# Altium schematic sheet MCU.SchDoc
size A4; Revision: B.2
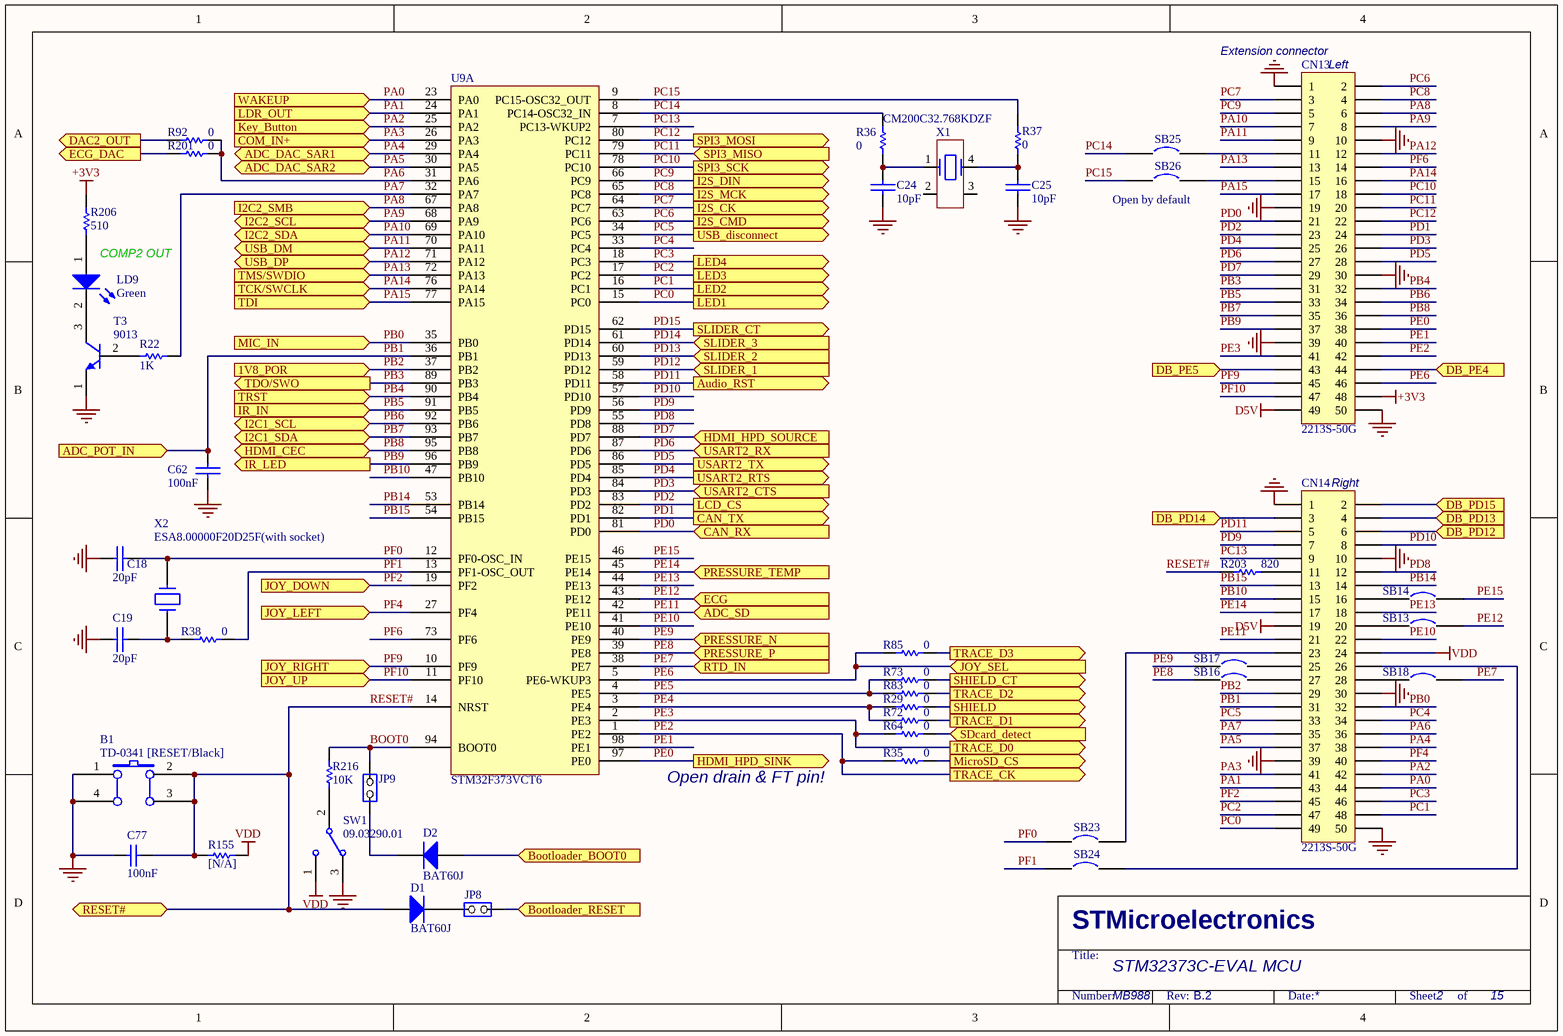
[diagram p0: MCU.SchDoc]

## Parts
B1  TD-0341 [RESET/Black]  [PB10]
C18  20pF  [0603C]
C19  20pF  [0603C]
C24  10pF  [0603C]
C25  10pF  [0603C]
C62  100nF  [0603C]
C77  100nF  [0603C]
CN13  2213S-50G  [2*25P]
CN14  2213S-50G  [2*25P]
D1  BAT60J  [SOD-323]
D2  BAT60J  [SOD-323]
JP8  (no value)  [SIP2]
JP9  (no value)  [SIP2]
LD9  Green  [0603D]
R22  1K  [0603R]
R29  0  [0603R]
R35  0  [0603R]
R36  0  [0603R]
R37  0  [0603R]
R38  0  [0603R]
R64  0  [0603R]
R72  0  [0603R]
R73  0  [0603R]
R83  0  [0603R]
R85  0  [0603R]
R92  0  [0603R]
R155  [N/A]  [0603R]
R201  0  [0603R]
R203  820  [0603R]
R206  510  [0603R]
R216  10K  [0603R]
SB13  (no value)  [JP2_SMD]
SB14  (no value)  [JP2_SMD]
SB16  (no value)  [JP2_SMD]
SB17  (no value)  [JP2_SMD]
SB18  (no value)  [JP2_SMD]
SB23  (no value)  [JP2_SMD]
SB24  (no value)  [JP2_SMD]
SB25  (no value)  [JP2_SMD]
SB26  (no value)  [JP2_SMD]
SW1  09.03290.01  [SIP3]
T3  9013  [SOT-23]
U9  STM32F373VCT6  [IC149-100-025-B5]  (part A of 2)
X1  CM200C32.768KDZF  [SM8]
X2  ESA8.00000F20D25F(with socket)  [XTAL_socket]

## Ports
1V8_POR (in), ADC_DAC_SAR1 (bidir), ADC_DAC_SAR2 (bidir), ADC_POT_IN (in), ADC_SD (in), Audio_RST (out), Bootloader_BOOT0 (in), Bootloader_RESET (in), CAN_RX (in), CAN_TX (out), COM_IN+ (in), DAC2_OUT (out), DB_PD12 (in), DB_PD13 (in), DB_PD14 (in), DB_PD15 (in), DB_PE4 (in), DB_PE5 (in), ECG (in), ECG_DAC (out), HDMI_CEC (bidir), HDMI_HPD_SINK (out), HDMI_HPD_SOURCE (in), I2C1_SCL (bidir), I2C1_SDA (bidir), I2C2_SCL (bidir), I2C2_SDA (bidir), I2C2_SMB (in), I2S_CK (out), I2S_CMD (out), I2S_DIN (out), I2S_MCK (out), IR_IN (in), IR_LED (out), JOY_DOWN (in), JOY_LEFT (in), JOY_RIGHT (in), JOY_SEL (in), JOY_UP (in), Key_Button (in), LCD_CS (out), LDR_OUT (in), LED1 (out), LED2 (out), LED3 (out), LED4 (out), MIC_IN (in), MicroSD_CS (out), PRESSURE_N (in), PRESSURE_P (in), PRESSURE_TEMP (in), RESET# (bidir), RTD_IN (in), SDcard_detect (in), SHIELD (out), SHIELD_CT (out), SLIDER_1 (in), SLIDER_2 (in), SLIDER_3 (in), SLIDER_CT (out), SPI3_MISO (in), SPI3_MOSI (out), SPI3_SCK (out), TCK/SWCLK (in), TDI (in), TDO/SWO (out), TMS/SWDIO (in), TRACE_CK (out), TRACE_D0 (out), TRACE_D1 (out), TRACE_D2 (out), TRACE_D3 (out), TRST (in), USART2_CTS (in), USART2_RTS (out), USART2_RX (in), USART2_TX (out), USB_disconnect (out), USB_DM (bidir), USB_DP (bidir), WAKEUP (in)

## Nets
+3V3: CN13.48 R206.1
D5V: CN13.49 CN14.19
GND: B1.1(A0) B1.4(A1) C18.2 C19.2 C24.2 C25.2 C62.1 C77.1 CN13.1 CN13.10 CN13.19 CN13.30 CN13.39 CN13.50 CN14.1 CN14.10 CN14.30 CN14.39 CN14.50 SW1.3 T3.1(E)
VDD: CN14.24 R155.2 SW1.1
BOOT0: JP9.2(NO) R216.1 U9.94(BOOT0)
Bootloader_BOOT0: D2.1(A) ; port Bootloader_BOOT0
Bootloader_RESET: JP8.2(NO) ; port Bootloader_RESET
DAC2_OUT: R92.2 ; port DAC2_OUT
DB_PD12: CN14.6 ; port DB_PD12
DB_PD13: CN14.4 ; port DB_PD13
DB_PD14: CN14.3 ; port DB_PD14
DB_PD15: CN14.2 ; port DB_PD15
DB_PE4: CN13.44 ; port DB_PE4
DB_PE5: CN13.43 ; port DB_PE5
ECG_DAC: R201.2 ; port ECG_DAC
MicroSD_CS: R35.1 ; port MicroSD_CS
PA0: CN14.44 U9.23(PA0) ; port WAKEUP
PA1: CN14.43 U9.24(PA1) ; port LDR_OUT
PA2: CN14.42 U9.25(PA2) ; port Key_Button
PA3: CN14.41 U9.26(PA3) ; port COM_IN+
PA4: CN14.38 U9.29(PA4) ; port ADC_DAC_SAR1
PA5: CN14.37 U9.30(PA5) ; port ADC_DAC_SAR2
PA6: CN14.36 R92.1 R201.1 U9.31(PA6)
PA7: CN14.35 R22.2 U9.32(PA7)
PA8: CN13.6 U9.67(PA8) ; port I2C2_SMB
PA9: CN13.8 U9.68(PA9) ; port I2C2_SCL
PA10: CN13.7 U9.69(PA10) ; port I2C2_SDA
PA11: CN13.9 U9.70(PA11) ; port USB_DM
PA12: CN13.12 U9.71(PA12) ; port USB_DP
PA13: CN13.13 U9.72(PA13) ; port TMS/SWDIO
PA14: CN13.16 U9.76(PA14) ; port TCK/SWCLK
PA15: CN13.17 U9.77(PA15) ; port TDI
PB0: CN14.32 U9.35(PB0) ; port MIC_IN
PB1: C62.2 CN14.31 U9.36(PB1) ; port ADC_POT_IN
PB2: CN14.29 U9.37(PB2) ; port 1V8_POR
PB3: CN13.31 U9.89(PB3) ; port TDO/SWO
PB4: CN13.32 U9.90(PB4) ; port TRST
PB5: CN13.33 U9.91(PB5) ; port IR_IN
PB6: CN13.34 U9.92(PB6) ; port I2C1_SCL
PB7: CN13.35 U9.93(PB7) ; port I2C1_SDA
PB8: CN13.36 U9.95(PB8) ; port HDMI_CEC
PB9: CN13.37 U9.96(PB9) ; port IR_LED
PB10: CN14.15 U9.47(PB10)
PB14: CN14.14 U9.53(PB14)
PB15: CN14.13 U9.54(PB15)
PC0: CN14.49 U9.15(PC0) ; port LED1
PC1: CN14.48 U9.16(PC1) ; port LED2
PC2: CN14.47 U9.17(PC2) ; port LED3
PC3: CN14.46 U9.18(PC3) ; port LED4
PC4: CN14.34 U9.33(PC4)
PC5: CN14.33 U9.34(PC5) ; port USB_disconnect
PC6: CN13.2 U9.63(PC6) ; port I2S_CMD
PC7: CN13.3 U9.64(PC7) ; port I2S_CK
PC8: CN13.4 U9.65(PC8) ; port I2S_MCK
PC9: CN13.5 U9.66(PC9) ; port I2S_DIN
PC10: CN13.18 U9.78(PC10) ; port SPI3_SCK
PC11: CN13.20 U9.79(PC11) ; port SPI3_MISO
PC12: CN13.22 U9.80(PC12) ; port SPI3_MOSI
PC13: CN14.9 U9.7(PC13-WKUP2)
PC14: R36.2 SB25.1 U9.8(PC14-OSC32_IN)
PC15: R37.2 SB26.1 U9.9(PC15-OSC32_OUT)
PD0: CN13.21 U9.81(PD0) ; port CAN_RX
PD1: CN13.24 U9.82(PD1) ; port CAN_TX
PD2: CN13.23 U9.83(PD2) ; port LCD_CS
PD3: CN13.26 U9.84(PD3) ; port USART2_CTS
PD4: CN13.25 U9.85(PD4) ; port USART2_RTS
PD5: CN13.28 U9.86(PD5) ; port USART2_TX
PD6: CN13.27 U9.87(PD6) ; port USART2_RX
PD7: CN13.29 U9.88(PD7) ; port HDMI_HPD_SOURCE
PD8: CN14.12 U9.55(PD8)
PD9: CN14.7 U9.56(PD9)
PD10: CN14.8 U9.57(PD10)
PD11: CN14.5 U9.58(PD11) ; port Audio_RST
PD12: U9.59(PD12) ; port SLIDER_1
PD13: U9.60(PD13) ; port SLIDER_2
PD14: U9.61(PD14) ; port SLIDER_3
PD15: U9.62(PD15) ; port SLIDER_CT
PE0: CN13.38 U9.97(PE0) ; port HDMI_HPD_SINK
PE1: CN13.40 U9.98(PE1)
PE2: CN13.42 R35.2 U9.1(PE2) ; port TRACE_CK
PE3: CN13.41 R64.2 U9.2(PE3) ; port TRACE_D0
PE4: R29.2 R72.2 U9.3(PE4)
PE5: R73.2 R83.2 U9.4(PE5)
PE6: CN13.46 R85.2 U9.5(PE6-WKUP3) ; port JOY_SEL
PE7: SB18.2 U9.38(PE7) ; port RTD_IN
PE8: SB16.1 U9.39(PE8) ; port PRESSURE_P
PE9: SB17.1 U9.40(PE9) ; port PRESSURE_N
PE10: CN14.22 U9.41(PE10)
PE11: CN14.21 U9.42(PE11) ; port ADC_SD
PE12: SB13.2 U9.43(PE12) ; port ECG
PE13: CN14.18 U9.44(PE13)
PE14: CN14.17 U9.45(PE14) ; port PRESSURE_TEMP
PE15: SB14.2 U9.46(PE15)
PF0: C18.1 SB23.1 U9.12(PF0-OSC_IN) X2.2
PF1: R38.1 SB24.1 U9.13(PF1-OSC_OUT)
PF2: CN14.45 U9.19(PF2) ; port JOY_DOWN
PF4: CN14.40 U9.27(PF4) ; port JOY_LEFT
PF6: CN13.14 U9.73(PF6)
PF9: CN13.45 U9.10(PF9) ; port JOY_RIGHT
PF10: CN13.47 U9.11(PF10) ; port JOY_UP
RESET#: B1.2(B0) B1.3(B1) C77.2 D1.1(A) R155.1 R203.2 U9.14(NRST) ; port RESET#
SDcard_detect: R64.1 ; port SDcard_detect
SHIELD: R29.1 ; port SHIELD
SHIELD_CT: R73.1 ; port SHIELD_CT
TRACE_D1: R72.1 ; port TRACE_D1
TRACE_D2: R83.1 ; port TRACE_D2
TRACE_D3: R85.1 ; port TRACE_D3
NetC19_1: C19.1 R38.2 X2.1
NetC24_1: C24.1 R36.1 X1.1
NetC25_1: C25.1 R37.1 X1.4
NetCN13_11: CN13.11 SB25.2
NetCN13_15: CN13.15 SB26.2
NetCN14_11: CN14.11 R203.1
NetCN14_16: CN14.16 SB14.1
NetCN14_20: CN14.20 SB13.1
NetCN14_23: CN14.23 SB23.2
NetCN14_25: CN14.25 SB17.2
NetCN14_26: CN14.26 SB24.2
NetCN14_27: CN14.27 SB16.2
NetCN14_28: CN14.28 SB18.1
NetD1_2: D1.2(K) JP8.1(COMMON)
NetD2_2: D2.2(K) JP9.1(COMMON)
NetLD9_1: LD9.1(A) R206.2
NetLD9_2: LD9.2(K) T3.3(C)
NetR22_1: R22.1 T3.2(B)
NetR216_2: R216.2 SW1.2

Not connected (* = marked no-connect by the designer): X1 2 3

## Notes on the sheet
- (near CN13) Extension connector
- (near CN13) Left
- (near SB26) Open by default
- COMP2 OUT
- (near CN14) Right
- Open drain & FT pin!
- STM32373C-EVAL MCU
- MB988
- 2
- 15
- STMicroelectronics
- Title:
- Number:
- Rev:
- Date:
- Sheet       of

## Library data of the parts
B1 = SW PUSHBUTTON: SE PUSHBUTTON
C18 C19 C24 C25 C62 = CAP: Capacitor
C77 = CAP: Capacitor; Value: 100pF; Published: 8-Jun-2000; Revision: July-2002: Re-released for DXP Platform.; Publisher: Altium Limited
CN13 CN14 = Header 25X2: Header, 25-Pin, Dual row; Revision: 17-Jul-2002: Re-released for DXP Platform.; Publisher: Altium Limited
D1 D2 = Diode: Default Diode; Code - JEDEC: DO-214-AB; Published: 8-Jun-2000; Revision: July-2002: Re-released for DXP Platform.; Publisher: Altium Limited
JP8 JP9 = JP2
LD9 = LED2: Typical RED, GREEN, YELLOW, AMBER GaAs LED; Published: 8-Jun-2000; Revision: July-2002: Re-released for DXP Platform.; Publisher: Altium Limited
R22 = Res1: Resistor; Published: 8-Jun-2000; Revision: July-2002: Re-released for DXP Platform.; Publisher: Altium Limited; Value: 1K
R29 R35-R38 R64 R72 R73 R83 R85 R92 R201 R203 R206 = Res1: Resistor; Value: 1K; Published: 8-Jun-2000; Revision: July-2002: Re-released for DXP Platform.; Publisher: Altium Limited
R155 R216 = res1: Resistor; Value: 1K; Published: 8-Jun-2000; Revision: July-2002: Re-released for DXP Platform.; Publisher: Altium Limited
SB13 SB14 SB16-SB18 SB23-SB26 = Circuit Breaker: Published: 24-Mar-1999; Revision: July-2002: Re-released for DXP Platform.; Publisher: Altium Limited
SW1 = SW-SPDT: SPDT Subminiature Toggle Switch, Right Angle Mounting, Vertical Actuation; Revision 1: Jul-2002: Re-released for DXP Platform.; Revision 2: 17-Dec-2003: Schematic revised, PCB Footprint replaced.; Published: 24-Mar-1999; Datasheet: Latest Revision: 05-Dec-2000; Publisher: Altium Limited
T3 = NPN: NPN Bipolar Transistor; Code - JEDEC: TO-226-AA; Published: 8-Jun-2000; Revision: July-2002: Re-released for DXP Platform.; Publisher: Altium Limited
U9 = Goldfish
X1 = MC306
X2 = CRYSTAL